# EAGLE schematic HTVC_3080 (EAGLE 7.4.0)
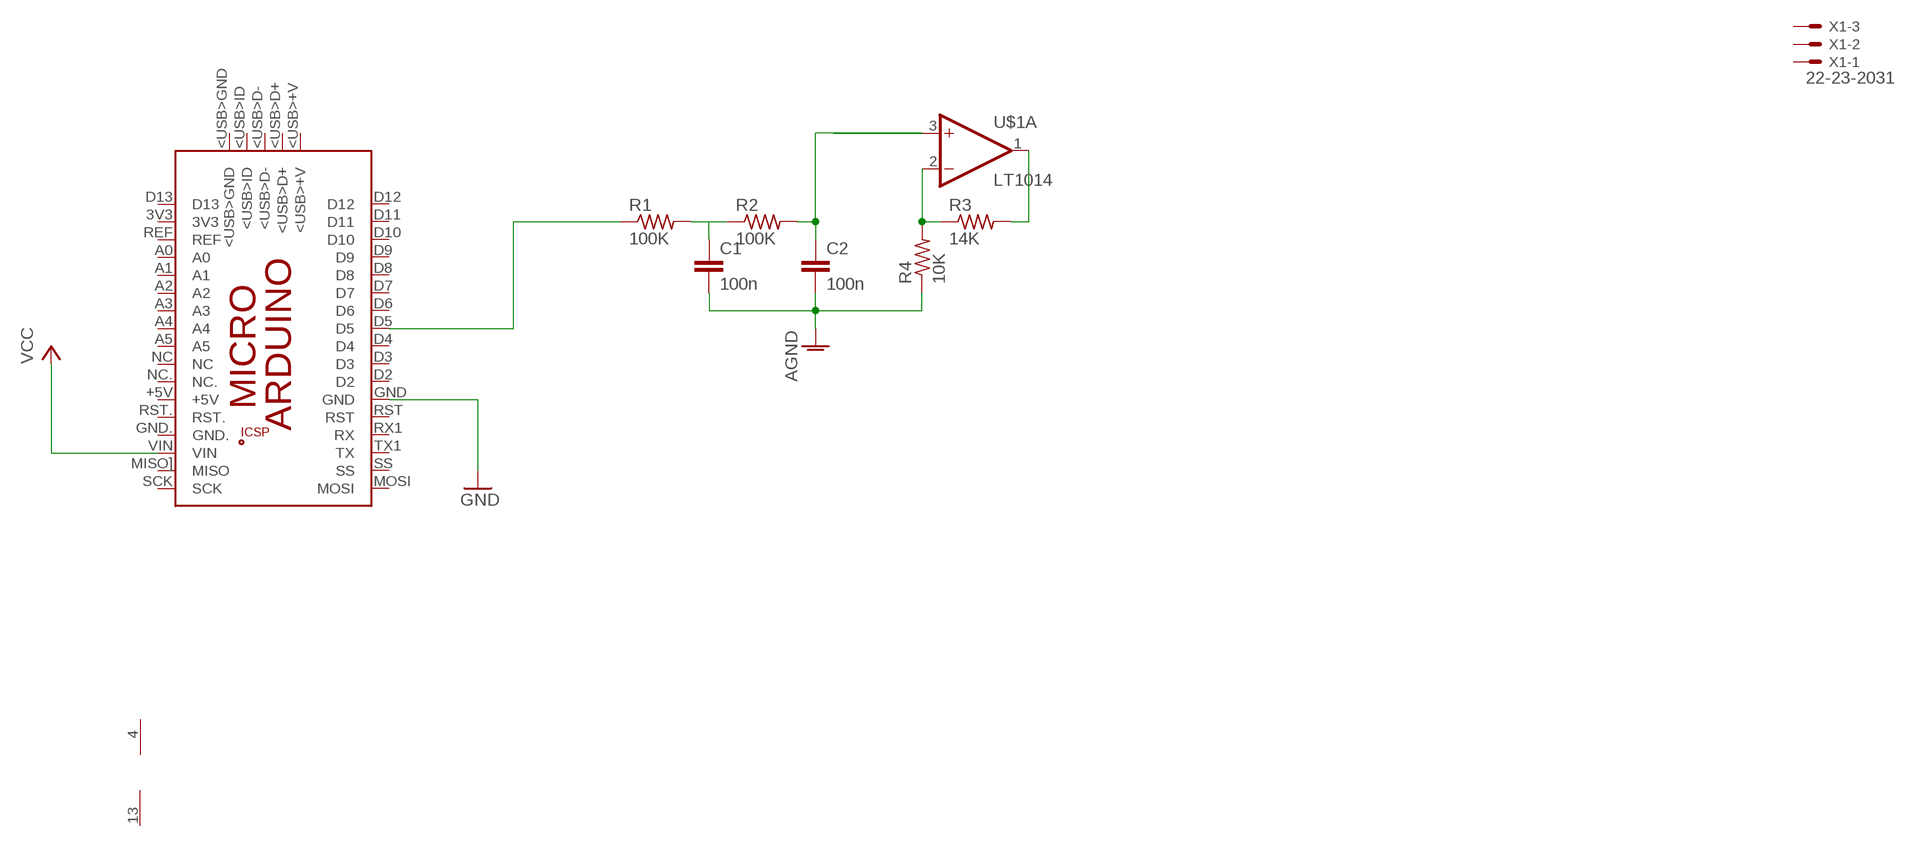
[diagram p0: schematic, sheet 1]

## Parts
C1  100n  C-EUC0805  [C0805]
C2  100n  C-EUC0805  [C0805]
PCB1  ARDUINO_MICRO  [ARDUINO_MICRO]
R1  100K  R-US_R0805  [R0805]
R2  100K  R-US_R0805  [R0805]
R3  14K  R-US_R0805  [R0805]
R4  10K  R-US_R0805  [R0805]
U$1  LT1014  [SO16]
X1  22-23-2031  [22-23-2031]

## Nets
AGND: C1.2 C2.2 R4.1
GND: PCB1.GND
N$2: PCB1.D5 R1.1
N$3: R3.2 U$1.1(A:OUT)
N$5: C1.1 R1.2 R2.1
N$6: C2.1 R2.2 U$1.3(A:+IN)
N$7: R3.1 R4.2 U$1.2(A:-IN)
VCC: PCB1.VIN
Unconnected: PCB1.3V3 PCB1.5V PCB1.+5V PCB1.<USB>+V PCB1.<USB>D+ PCB1.<USB>D- PCB1.<USB>GND PCB1.<USB>ID PCB1.A0 PCB1.A1 PCB1.A2 PCB1.A3 PCB1.A4 PCB1.A5 PCB1.D2 PCB1.D3 PCB1.D4 PCB1.D6 PCB1.D7 PCB1.D8 PCB1.D9 PCB1.D10 PCB1.D11 PCB1.D12 PCB1.D13 PCB1.GND. PCB1.GND_ PCB1.MISO. PCB1.MISO](MISO) PCB1.MOSI PCB1.MOSI. PCB1.NC PCB1.NC. PCB1.REF PCB1.RESET.. PCB1.RST PCB1.RST. PCB1.RX1(RX) PCB1.SCK PCB1.SCK. PCB1.SS PCB1.TX1(TX) U$1.5(B:+IN) U$1.6(B:-IN) U$1.7(B:OUT) U$1.10(C:OUT) U$1.11(C:-IN) U$1.12(C:+IN) U$1.14(D:+IN) U$1.15(D:-IN) U$1.16(D:OUT) X1.1 X1.2 X1.3

## Power pins joined to a net without a drawn wire
V+: U$1.4(P:V+)
V-: U$1.13(P:V-)

## Library data of the parts
C1 C2 = resistor:C-EU: CAPACITOR, European symbol
PCB1 = E14_Arduino_revB:ARDUINO_MICRO: Device for representing an Arduino Micro board with a footprint in an EAGLE design. Created by Dave Young for Element14. More EAGLE documentation at: http://www.element14.com/community/community/knode/cadsoft_eagle
R1-R4 = resistor:R-US_: RESISTOR, American symbol
U$1 = nervus:LT1014: Quad Precision Op AmpDatasheet <http://cds.linear.com/docs/en/datasheet/10134fd.pdf>
X1 = con-molex:22-23-2031: .100" (2.54mm) Center Header - 3 Pin; MF: MOLEX; MPN: 22-23-2031; OC_FARNELL: 1462950; OC_NEWARK: 30C0862

## Module PWMFILTER
Ports: 

### Library data of the parts

## Net classes
0 default: width 0.406 mm